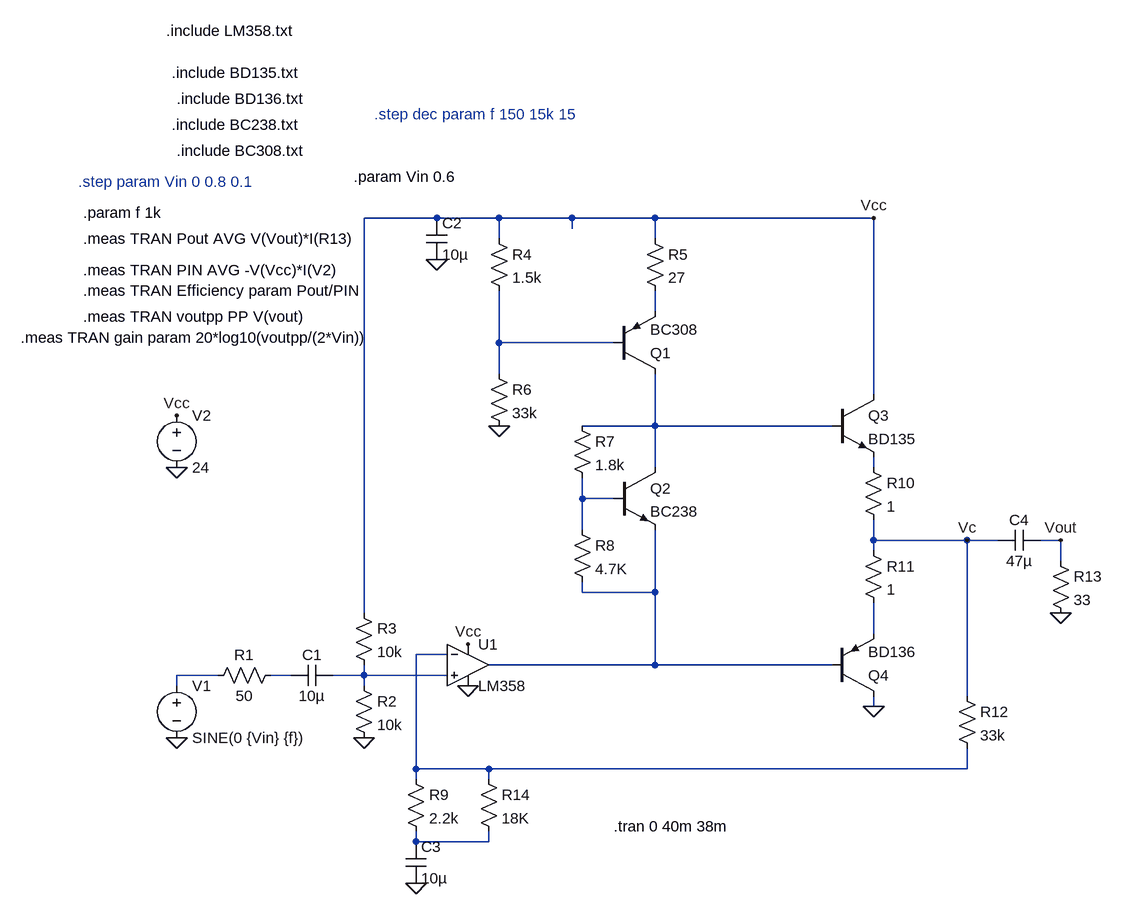
[diagram p0: schematic Lab4.asc]
Lab4.asc, the LTspice schematic file:
Version 4
SHEET 1 1988 680
WIRE 448 -608 336 -608
WIRE 544 -608 448 -608
WIRE 656 -608 544 -608
WIRE 784 -608 656 -608
WIRE 1120 -608 784 -608
WIRE 656 -592 656 -608
WIRE 544 -576 544 -608
WIRE 784 -576 784 -608
WIRE 784 -464 784 -496
WIRE 544 -416 544 -496
WIRE 720 -416 544 -416
WIRE 544 -368 544 -416
WIRE 1120 -336 1120 -608
WIRE 784 -288 784 -368
WIRE 784 -288 672 -288
WIRE 1056 -288 784 -288
WIRE 784 -224 784 -288
WIRE 1120 -224 1120 -240
WIRE 672 -176 672 -208
WIRE 720 -176 672 -176
WIRE 672 -128 672 -176
WIRE 1120 -112 1120 -144
WIRE 1264 -112 1120 -112
WIRE 1312 -112 1264 -112
WIRE 1408 -112 1376 -112
WIRE 1120 -96 1120 -112
WIRE 1408 -80 1408 -112
WIRE 672 -32 672 -48
WIRE 784 -32 784 -128
WIRE 784 -32 672 -32
WIRE 336 0 336 -608
WIRE 1120 32 1120 -16
WIRE 464 64 416 64
WIRE 784 80 784 -32
WIRE 784 80 528 80
WIRE 1056 80 784 80
WIRE 112 96 48 96
WIRE 224 96 192 96
WIRE 336 96 336 80
WIRE 336 96 288 96
WIRE 464 96 336 96
WIRE 48 112 48 96
WIRE 336 112 336 96
WIRE 1264 128 1264 -112
WIRE 1120 144 1120 128
WIRE 416 240 416 64
WIRE 528 240 416 240
WIRE 1264 240 1264 208
WIRE 1264 240 528 240
WIRE 416 256 416 240
WIRE 528 256 528 240
WIRE 416 352 416 336
WIRE 528 352 528 336
WIRE 528 352 416 352
FLAG 336 192 0
FLAG 448 -544 0
FLAG 544 -288 0
FLAG 416 416 0
FLAG 48 192 0
FLAG 1120 144 0
FLAG 1408 0 0
FLAG 1408 -112 Vout
FLAG 1120 -608 Vcc
FLAG 48 -304 Vcc
FLAG 496 48 Vcc
FLAG 48 -224 0
FLAG 1264 -112 Vc
FLAG 496 112 0
SYMBOL voltage 48 96 R0
WINDOW 123 0 0 Left 0
WINDOW 39 0 0 Left 0
SYMATTR InstName V1
SYMATTR Value SINE(0 {Vin} {f})
SYMBOL res 208 80 R90
WINDOW 0 0 56 VBottom 2
WINDOW 3 32 56 VTop 2
SYMATTR InstName R1
SYMATTR Value 50
SYMBOL cap 288 80 R90
WINDOW 0 0 32 VBottom 2
WINDOW 3 32 32 VTop 2
SYMATTR InstName C1
SYMATTR Value 10µ
SYMBOL res 320 96 R0
SYMATTR InstName R2
SYMATTR Value 10k
SYMBOL res 320 -16 R0
SYMATTR InstName R3
SYMATTR Value 10k
SYMBOL OpAmps\\opamp2 496 16 R0
SYMATTR InstName U1
SYMATTR Value LM358
SYMBOL cap 432 -608 R0
SYMATTR InstName C2
SYMATTR Value 10µ
SYMBOL res 528 -592 R0
SYMATTR InstName R4
SYMATTR Value 1.5k
SYMBOL res 768 -592 R0
SYMATTR InstName R5
SYMATTR Value 27
SYMBOL res 528 -384 R0
SYMATTR InstName R6
SYMATTR Value 33k
SYMBOL pnp 720 -368 M180
SYMATTR InstName Q1
SYMATTR Value BC308
SYMBOL npn 720 -224 R0
SYMATTR InstName Q2
SYMATTR Value BC238
SYMBOL res 656 -304 R0
SYMATTR InstName R7
SYMATTR Value 1.8k
SYMBOL res 656 -144 R0
SYMATTR InstName R8
SYMATTR Value 4.7K
SYMBOL res 400 240 R0
SYMATTR InstName R9
SYMATTR Value 2.2k
SYMBOL cap 400 352 R0
SYMATTR InstName C3
SYMATTR Value 10µ
SYMBOL npn 1056 -336 R0
SYMATTR InstName Q3
SYMATTR Value BD135
SYMBOL res 1104 -240 R0
SYMATTR InstName R10
SYMATTR Value 1
SYMBOL cap 1376 -128 R90
WINDOW 0 0 32 VBottom 2
WINDOW 3 32 32 VTop 2
SYMATTR InstName C4
SYMATTR Value 47µ
SYMBOL res 1104 -112 R0
SYMATTR InstName R11
SYMATTR Value 1
SYMBOL pnp 1056 128 M180
SYMATTR InstName Q4
SYMATTR Value BD136
SYMBOL res 1248 112 R0
SYMATTR InstName R12
SYMATTR Value 33k
SYMBOL res 1392 -96 R0
SYMATTR InstName R13
SYMATTR Value 33
SYMBOL voltage 48 -320 R0
WINDOW 123 0 0 Left 0
WINDOW 39 0 0 Left 0
SYMATTR InstName V2
SYMATTR Value 24
SYMBOL res 512 240 R0
SYMATTR InstName R14
SYMATTR Value 18K
TEXT 32 -896 Left 2 !.include LM358.txt
TEXT 40 -832 Left 2 !.include BD135.txt
TEXT 48 -792 Left 2 !.include BD136.txt
TEXT 40 -752 Left 2 !.include BC238.txt
TEXT 48 -712 Left 2 !.include BC308.txt
TEXT -104 -664 Left 2 ;.step param Vin 0 0.8 0.1
TEXT -96 -616 Left 2 !.param f 1k
TEXT 720 328 Left 2 !.tran 0 40m 38m
TEXT -96 -576 Left 2 !.meas TRAN Pout AVG V(Vout)*I(R13)
TEXT -96 -528 Left 2 !.meas TRAN PIN AVG -V(Vcc)*I(V2)
TEXT -96 -496 Left 2 !.meas TRAN Efficiency param Pout/PIN
TEXT -96 -456 Left 2 !.meas TRAN voutpp PP V(vout)
TEXT -192 -424 Left 2 !.meas TRAN gain param 20*log10(voutpp/(2*Vin))
TEXT 320 -672 Left 2 !.param Vin 0.6
TEXT 352 -768 Left 2 ;.step dec param f 150 15k 15

The netlist it stands for:
* Lab4.asc
V1 N009 0 SINE(0 {Vin} {f})
R1 N010 N009 50
C1 N011 N010 10µ
R2 N011 0 10k
R3 Vcc N011 10k
XU1 N011 N008 Vcc 0 N006 LM358  ; pins In+ In- V+ V- OUT
C2 Vcc 0 10µ
R4 Vcc N002 1.5k
R5 Vcc N001 27
R6 N002 0 33k
Q1 N003 N002 N001 0 BC308
Q2 N003 N005 N006 0 BC238
R7 N003 N005 1.8k
R8 N005 N006 4.7K
R9 N008 N012 2.2k
C3 N012 0 10µ
Q3 Vcc N003 N004 0 BD135
R10 N004 Vc 1
C4 Vout Vc 47µ
R11 Vc N007 1
Q4 0 N006 N007 0 BD136
R12 Vc N008 33k
R13 Vout 0 33
V2 Vcc 0 24
R14 N008 N012 18K
.model NPN NPN
.model PNP PNP
.lib standard.bjt
.include LM358.txt
.include BD135.txt
.include BD136.txt
.include BC238.txt
.include BC308.txt
* .step param Vin 0 0.8 0.1
.param f 1k
.tran 0 40m 38m
.meas TRAN Pout AVG V(Vout)*I(R13)
.meas TRAN PIN AVG -V(Vcc)*I(V2)
.meas TRAN Efficiency param Pout/PIN
.meas TRAN voutpp PP V(vout)
.meas TRAN gain param 20*log10(voutpp/(2*Vin))
.param Vin 0.6
* .step dec param f 150 15k 15
.backanno
.end